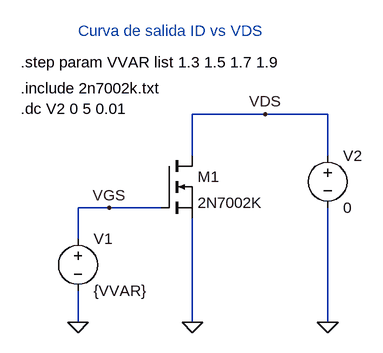
[diagram p0: schematic sim_nmos_salida.asc]
sim_nmos_salida.asc, the LTspice schematic file:
Version 4
SHEET 1 880 680
WIRE -336 -144 -448 -144
WIRE -240 -144 -336 -144
WIRE -448 -80 -448 -144
WIRE -240 -80 -240 -144
WIRE -576 0 -624 0
WIRE -496 0 -576 0
WIRE -624 48 -624 0
WIRE -624 176 -624 128
WIRE -448 176 -448 16
WIRE -240 176 -240 0
FLAG -576 0 VGS
FLAG -336 -144 VDS
FLAG -624 176 0
FLAG -448 176 0
FLAG -240 176 0
SYMBOL voltage -624 32 R0
WINDOW 123 0 0 Left 0
WINDOW 39 0 0 Left 0
SYMATTR InstName V1
SYMATTR Value {VVAR}
SYMBOL nmos -496 -80 R0
SYMATTR InstName M1
SYMATTR Value 2N7002K
SYMATTR Prefix X
SYMBOL voltage -240 -96 R0
WINDOW 123 0 0 Left 0
WINDOW 39 0 0 Left 0
SYMATTR InstName V2
SYMATTR Value 0
TEXT -712 -184 Left 2 !.include 2n7002k.txt
TEXT -712 -152 Left 2 !.dc V2 0 5 0.01
TEXT -624 -272 Left 2 ;Curva de salida ID vs VDS
TEXT -712 -224 Left 2 !.step param VVAR list 1.3 1.5 1.7 1.9

The netlist it stands for:
* sim_nmos_salida.asc
V1 VGS 0 {VVAR}
XM1 VDS VGS 0 2N7002K  ; pins D G S
V2 VDS 0 0
.include 2n7002k.txt
.dc V2 0 5 0.01
* Curva de salida ID vs VDS
.step param VVAR list 1.3 1.5 1.7 1.9
.backanno
.end